# Altium schematic sheet LTC2335-16_0.SchDoc
size A; SheetNumber: 10; SheetTotal: 24
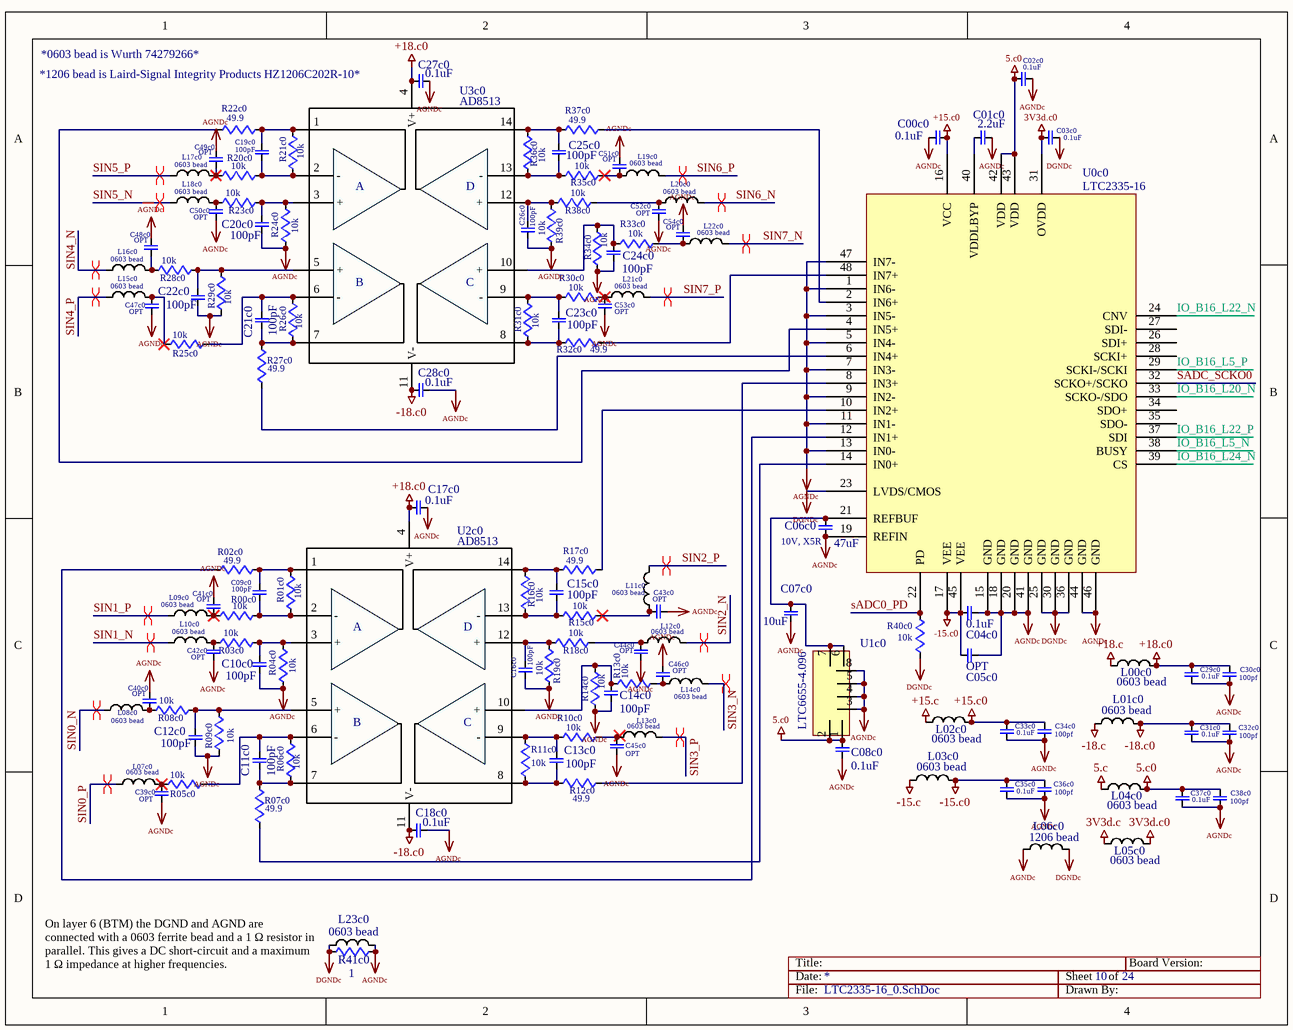
[diagram p0: LTC2335-16_0.SchDoc]

## Parts
C00c0  0.1uF  [0603]
C01c0  2.2uF  [0603]
C02c0  0.1uF  [0603]
C03c0  0.1uF  [0603]
C04c0  0.1uF  [0603]
C05c0  OPT  [0603]
C06c0  47uF  [1210]
C07c0  10uF  [0805]
C08c0  0.1uF  [0603]
C09c0  100pF  [0603]
C10c0  100pF  [0603]
C11c0  100pF  [0603]
C12c0  100pF  [0603]
C13c0  100pF  [0603]
C14c0  100pF  [0603]
C15c0  100pF  [0603]
C16c0  100pF  [0603]
C17c0  0.1uF  [0603]
C18c0  0.1uF  [0603]
C19c0  100pF  [0603]
C20c0  100pF  [0603]
C21c0  100pF  [0603]
C22c0  100pF  [0603]
C23c0  100pF  [0603]
C24c0  100pF  [0603]
C25c0  100pF  [0603]
C26c0  100pF  [0603]
C27c0  0.1uF  [0603]
C28c0  0.1uF  [0603]
C29c0  0.1uF  [0603]
C30c0  100pf  [0603]
C31c0  0.1uF  [0603]
C32c0  100pf  [0603]
C33c0  0.1uF  [0603]
C34c0  100pf  [0603]
C35c0  0.1uF  [0603]
C36c0  100pf  [0603]
C37c0  0.1uF  [0603]
C38c0  100pf  [0603]
C39c0  OPT  [0603]
C40c0  OPT  [0603]
C41c0  OPT  [0603]
C42c0  OPT  [0603]
C43c0  OPT  [0603]
C44c0  OPT  [0603]
C45c0  OPT  [0603]
C46c0  OPT  [0603]
C47c0  OPT  [0603]
C48c0  OPT  [0603]
C49c0  OPT  [0603]
C50c0  OPT  [0603]
C51c0  OPT  [0603]
C52c0  OPT  [0603]
C53c0  OPT  [0603]
C54c0  OPT  [0603]
L00c0  0603 bead  [0603]
L01c0  0603 bead  [0603]
L02c0  0603 bead  [0603]
L03c0  0603 bead  [0603]
L04c0  0603 bead  [0603]
L05c0  0603 bead  [0603]
L06c0  1206 bead  [1206]
L07c0  0603 bead  [0603]
L08c0  0603 bead  [0603]
L09c0  0603 bead  [0603]
L10c0  0603 bead  [0603]
L11c0  0603 bead  [0603]
L12c0  0603 bead  [0603]
L13c0  0603 bead  [0603]
L14c0  0603 bead  [0603]
L15c0  0603 bead  [0603]
L16c0  0603 bead  [0603]
L17c0  0603 bead  [0603]
L18c0  0603 bead  [0603]
L19c0  0603 bead  [0603]
L20c0  0603 bead  [0603]
L21c0  0603 bead  [0603]
L22c0  0603 bead  [0603]
L23c0  0603 bead  [0603]
R00c0  10k  [0603]
R01c0  10k  [0603]
R02c0  49.9  [0603]
R03c0  10k  [0603]
R04c0  10k  [0603]
R05c0  10k  [0603]
R06c0  10k  [0603]
R07c0  49.9  [0603]
R08c0  10k  [0603]
R09c0  10k  [0603]
R10c0  10k  [0603]
R11c0  10k  [0603]
R12c0  49.9  [0603]
R13c0  10k  [0603]
R14c0  10k  [0603]
R15c0  10k  [0603]
R16c0  10k  [0603]
R17c0  49.9  [0603]
R18c0  10k  [0603]
R19c0  10k  [0603]
R20c0  10k  [0603]
R21c0  10k  [0603]
R22c0  49.9  [0603]
R23c0  10k  [0603]
R24c0  10k  [0603]
R25c0  10k  [0603]
R26c0  10k  [0603]
R27c0  49.9  [0603]
R28c0  10k  [0603]
R29c0  10k  [0603]
R30c0  10k  [0603]
R31c0  10k  [0603]
R32c0  49.9  [0603]
R33c0  10k  [0603]
R34c0  10k  [0603]
R35c0  10k  [0603]
R36c0  10k  [0603]
R37c0  49.9  [0603]
R38c0  10k  [0603]
R39c0  10k  [0603]
R40c0  10k  [0603]
R41c0  1  [0603]
U0c0  LTC2335-16  [48LQFP]
U1c0  LTC6655-4.096  [8MSOP_1]
U2c0  AD8513  [14TSSOP]
U3c0  AD8513  [14TSSOP]

## Nets
3V3d.c: L05c0.1
3V3d.c0: C03c0.2 L05c0.2 U0c0.31(OVDD)
5.c: L04c0.1
5.c0: C02c0.2 C08c0.2 C37c0.1 C38c0.1 L04c0.2 U0c0.42(VDD) U0c0.43(VDD) U1c0.1(SHDN) U1c0.2(VIN)
+15.c: L02c0.1
+15.c0: C00c0.1 C33c0.1 C34c0.1 L02c0.2 U0c0.16(VCC)
+18.c: L00c0.1
+18.c0: C17c0.2 C27c0.2 C29c0.1 C30c0.1 L00c0.2 U2c0.4(V+) U3c0.4(V+)
-15.c: L03c0.1
-15.c0: C04c0.2 C05c0.2 C35c0.1 C36c0.1 L03c0.2 U0c0.17(VEE) U0c0.45(VEE)
-18.c: L01c0.1
-18.c0: C18c0.2 C28c0.2 C31c0.1 C32c0.1 L01c0.2 U2c0.11(V-) U3c0.11(V-)
AGNDc: C00c0.2 C01c0.1 C02c0.1 C04c0.1 C05c0.1 C06c0.1 C07c0.1 C08c0.1 C10c0.2 C12c0.2 C14c0.2 C16c0.2 C17c0.1 C18c0.1 C20c0.2 C22c0.2 C24c0.1 C26c0.2 C27c0.1 C28c0.1 C29c0.2 C30c0.2 C31c0.2 C32c0.2 C33c0.2 C34c0.2 C35c0.2 C36c0.2 C37c0.2 C38c0.2 C39c0.2 C40c0.1 C41c0.1 C42c0.2 C43c0.1 C44c0.1 C45c0.1 C46c0.1 C47c0.2 C48c0.1 C49c0.1 C50c0.2 C51c0.1 C52c0.2 C53c0.2 C54c0.1 L06c0.1 L23c0.2 R04c0.1 R09c0.1 R14c0.1 R19c0.1 R24c0.1 R29c0.1 R34c0.1 R39c0.1 R41c0.1 U0c0.1(IN6-) U0c0.3(IN5-) U0c0.5(IN4-) U0c0.7(IN3-) U0c0.9(IN2-) U0c0.11(IN1-) U0c0.13(IN0-) U0c0.15(GND) U0c0.18(GND) U0c0.19(REFIN) U0c0.20(GND) U0c0.41(GND) U0c0.44(GND) U0c0.46(GND) U0c0.47(IN7-) U1c0.3(GND) U1c0.4(GND) U1c0.5(GND) U1c0.8(GND)
DGNDc: C03c0.1 L06c0.2 L23c0.1 R40c0.1 R41c0.2 U0c0.23(LVDS/CMOS) U0c0.25(GND) U0c0.30(GND) U0c0.36(GND)
IO_B16_L5_N: U0c0.38(BUSY)
IO_B16_L5_P: U0c0.29(SCKI-/SCKI)
IO_B16_L20_N: U0c0.33(SCKO-/SDO)
IO_B16_L22_N: U0c0.24(CNV)
IO_B16_L22_P: U0c0.37(SDI)
IO_B16_L24_N: U0c0.39(CS)
sADC0_PD: R40c0.2 U0c0.22(PD)
SADC_SCKO0: U0c0.32(SCKO+/SCKO)
SIN0_N: L08c0.1
SIN0_P: L07c0.1
SIN1_N: L10c0.1
SIN1_P: L09c0.1
SIN2_N: L12c0.2
SIN2_P: L11c0.2
SIN3_N: L14c0.2
SIN3_P: L13c0.2
SIN4_N: L16c0.1
SIN4_P: L15c0.1
SIN5_N: L18c0.1
SIN5_P: L17c0.1
SIN6_N: L20c0.2
SIN6_P: L19c0.2
SIN7_N: L22c0.2
SIN7_P: L21c0.2
NetC01c0_2: C01c0.2 U0c0.40(VDDLBYP)
NetC06c0_2: C06c0.2 C07c0.2 U0c0.21(REFBUF) U1c0.6(VOUT_S) U1c0.7(VOUT_F)
NetC09c0_1: C09c0.1 R01c0.2 R02c0.2 U2c0.1(OUTA)
NetC09c0_2: C09c0.2 R00c0.2 R01c0.1 U2c0.2(-)
NetC10c0_1: C10c0.1 R03c0.2 R04c0.2 U2c0.3(+)
NetC11c0_1: C11c0.1 R06c0.1 R07c0.2 U2c0.7(OUTB)
NetC11c0_2: C11c0.2 R05c0.1 R06c0.2 U2c0.6(-)
NetC12c0_1: C12c0.1 R08c0.2 R09c0.2 U2c0.5(+)
NetC13c0_1: C13c0.1 R11c0.1 R12c0.1 U2c0.8(OUTB)
NetC13c0_2: C13c0.2 R10c0.1 R11c0.2 U2c0.9(-)
NetC14c0_1: C14c0.1 R13c0.1 R14c0.2 U2c0.10(+)
NetC15c0_1: C15c0.1 R16c0.2 R17c0.1 U2c0.14(OUTA)
NetC15c0_2: C15c0.2 R15c0.1 R16c0.1 U2c0.13(-)
NetC16c0_1: C16c0.1 R18c0.1 R19c0.2 U2c0.12(+)
NetC19c0_1: C19c0.1 R21c0.2 R22c0.2 U3c0.1(OUTA)
NetC19c0_2: C19c0.2 R20c0.2 R21c0.1 U3c0.2(-)
NetC20c0_1: C20c0.1 R23c0.2 R24c0.2 U3c0.3(+)
NetC21c0_1: C21c0.1 R26c0.1 R27c0.2 U3c0.7(OUTB)
NetC21c0_2: C21c0.2 R25c0.1 R26c0.2 U3c0.6(-)
NetC22c0_1: C22c0.1 R28c0.2 R29c0.2 U3c0.5(+)
NetC23c0_1: C23c0.1 R31c0.1 R32c0.1 U3c0.8(OUTB)
NetC23c0_2: C23c0.2 R30c0.1 R31c0.2 U3c0.9(-)
NetC24c0_2: C24c0.2 R33c0.1 R34c0.2 U3c0.10(+)
NetC25c0_1: C25c0.1 R36c0.2 R37c0.1 U3c0.14(OUTA)
NetC25c0_2: C25c0.2 R35c0.1 R36c0.1 U3c0.13(-)
NetC26c0_1: C26c0.1 R38c0.1 R39c0.2 U3c0.12(+)
NetC39c0_1: C39c0.1 L07c0.2 R05c0.2
NetC40c0_2: C40c0.2 L08c0.2 R08c0.1
NetC41c0_2: C41c0.2 L09c0.2 R00c0.1
NetC42c0_1: C42c0.1 L10c0.2 R03c0.1
NetC43c0_2: C43c0.2 L11c0.1 R15c0.2
NetC44c0_2: C44c0.2 L12c0.1 R18c0.2
NetC45c0_2: C45c0.2 L13c0.1 R10c0.2
NetC46c0_2: C46c0.2 L14c0.1 R13c0.2
NetC47c0_1: C47c0.1 L15c0.2 R25c0.2
NetC48c0_2: C48c0.2 L16c0.2 R28c0.1
NetC49c0_2: C49c0.2 L17c0.2 R20c0.1
NetC50c0_1: C50c0.1 L18c0.2 R23c0.1
NetC51c0_2: C51c0.2 L19c0.1 R35c0.2
NetC52c0_1: C52c0.1 L20c0.1 R38c0.2
NetC53c0_1: C53c0.1 L21c0.1 R30c0.2
NetC54c0_2: C54c0.2 L22c0.1 R33c0.2
NetR02c0_1: R02c0.1 U0c0.12(IN1+)
NetR07c0_1: R07c0.1 U0c0.14(IN0+)
NetR12c0_2: R12c0.2 U0c0.8(IN3+)
NetR17c0_2: R17c0.2 U0c0.10(IN2+)
NetR22c0_1: R22c0.1 U0c0.4(IN5+)
NetR27c0_1: R27c0.1 U0c0.6(IN4+)
NetR32c0_2: R32c0.2 U0c0.48(IN7+)
NetR37c0_2: R37c0.2 U0c0.2(IN6+)

Not connected (* = marked no-connect by the designer): U0c0 26(SDI+) 27(SDI-) 28(SCKI+) 34(SDO+) 35(SDO-)

## Layout directives
differential pair: SIN0_N, SIN0_P, SIN1_N, SIN1_P, SIN2_N, SIN2_P, SIN3_N, SIN3_P, SIN4_N, SIN4_P, SIN5_N, SIN5_P, SIN6_N, SIN6_P, SIN7_N, SIN7_P

## Notes on the sheet
- (near C27c0) *1206 bead is Laird-Signal Integrity Products HZ1206C202R-10*
- *0603 bead is Wurth 74279266*
- (near C06c0) 10V, X5R
- On layer 6 (BTM) the DGND and AGND are connected with a 0603 ferrite bead and a 1 Ω resistor in parallel. This gives a DC short-circuit and a maximum 1 Ω impedance at higher frequencies.
- Title:
- Date:
- Sheet
- of
- Board Version:
- File:
- Drawn By:
- (in symbol OPAMPx4) A; D; B; C

## Library data of the parts
C00c0 C01c0 C02c0 C03c0 C04c0 C05c0 C06c0 C07c0 C08c0 C09c0 C10c0 C11c0 C12c0 C13c0 C14c0 C15c0 C16c0 C17c0 C18c0 C19c0 C20c0 C21c0 C22c0 C23c0 C24c0 C25c0 C26c0 C27c0 C28c0 C29c0 C30c0 C31c0 C32c0 C33c0 C34c0 C35c0 C36c0 C37c0 C38c0 C39c0 C40c0 C41c0 C42c0 C43c0 C44c0 C45c0 C46c0 C47c0 C48c0 C49c0 C50c0 C51c0 C52c0 C53c0 C54c0 = CAP
L00c0 L01c0 L02c0 L03c0 L04c0 L05c0 L06c0 L07c0 L08c0 L09c0 L10c0 L11c0 L12c0 L13c0 L14c0 L15c0 L16c0 L17c0 L18c0 L19c0 L20c0 L21c0 L22c0 L23c0 = INDUCTOR
R00c0 R01c0 R02c0 R03c0 R04c0 R05c0 R06c0 R07c0 R08c0 R09c0 R10c0 R11c0 R12c0 R13c0 R14c0 R15c0 R16c0 R17c0 R18c0 R19c0 R20c0 R21c0 R22c0 R23c0 R24c0 R25c0 R26c0 R27c0 R28c0 R29c0 R30c0 R31c0 R32c0 R33c0 R34c0 R35c0 R36c0 R37c0 R38c0 R39c0 R40c0 R41c0 = RES
U1c0 = LTC6655
U2c0 U3c0 = OPAMPx4